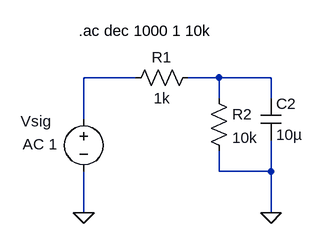
[diagram p0: schematic FILTRO - Passa_Baixa_passivo_freq_ex_1.asc]
FILTRO - Passa_Baixa_passivo_freq_ex_1.asc, the LTspice schematic file:
Version 4
SHEET 1 1008 680
WIRE -112 48 -192 48
WIRE 16 48 -32 48
WIRE 96 48 16 48
WIRE 16 80 16 48
WIRE 96 80 96 48
WIRE -192 112 -192 48
WIRE 16 192 16 160
WIRE 96 192 96 144
WIRE 96 192 16 192
WIRE -192 256 -192 192
WIRE 96 256 96 192
FLAG -192 256 0
FLAG 96 256 0
SYMBOL res -16 32 R90
WINDOW 0 0 56 VBottom 2
WINDOW 3 32 56 VTop 2
SYMATTR InstName R1
SYMATTR Value 1k
SYMBOL voltage -192 96 R0
WINDOW 123 -94 54 Left 2
WINDOW 39 0 0 Left 0
WINDOW 3 -247 80 Left 2
WINDOW 0 -97 19 Left 2
SYMATTR Value2 AC 1
SYMATTR Value ""
SYMATTR InstName Vsig
SYMBOL cap 80 80 R0
SYMATTR InstName C2
SYMATTR Value 10µ
SYMBOL res 0 64 R0
SYMATTR InstName R2
SYMATTR Value 10k
TEXT -200 -24 Left 2 !.ac dec 1000 1 10k

The netlist it stands for:
* FILTRO - Passa_Baixa_passivo_freq_ex_1.asc
R1 N002 N001 1k
Vsig N001 0 AC 1
C2 N002 0 10µ
R2 N002 0 10k
.ac dec 1000 1 10k
.backanno
.end